# EAGLE board MSUT (EAGLE 9.6.2)
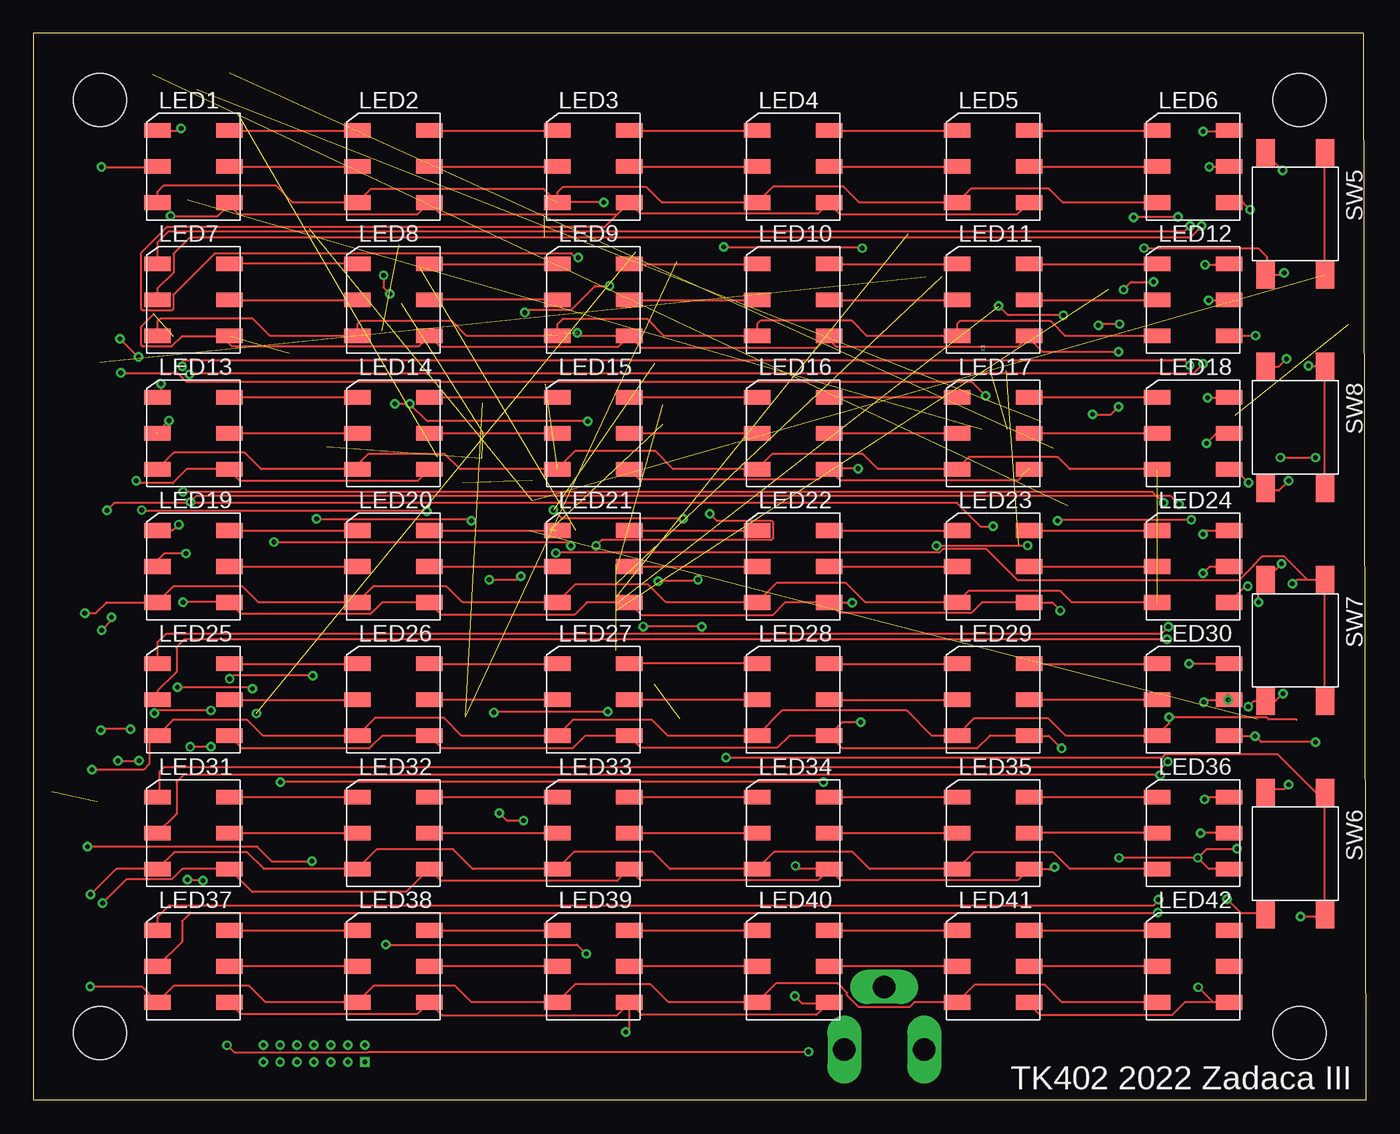
[diagram p2: board, top side]
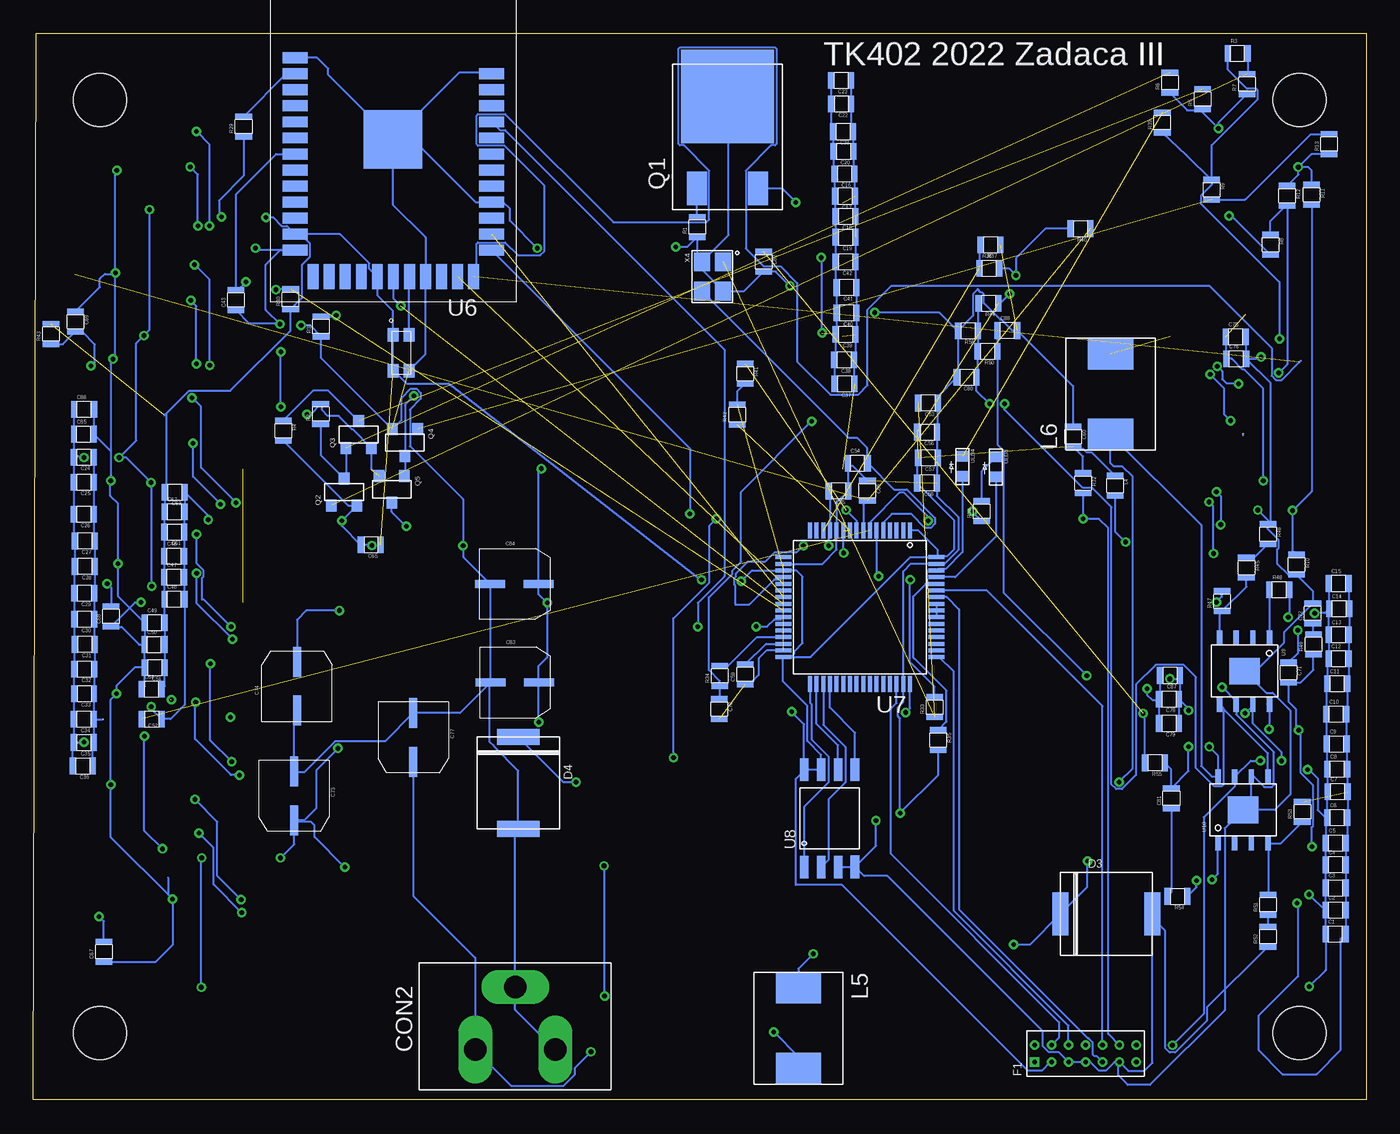
[diagram p3: board, bottom side, seen from below]

Size 100 x 80 mm. Coordinates in mm from the lower left corner, seen from the top.
Outline: 0,0 100,0 99.8,80 0,80 0,0
Copper layers (1*16): Top 0.0356mm / dielectric 1.5011mm / Bottom 0.0356mm
Design rules "oshpark-2layer-saved": minimum track width 6mil, minimum drill 13mil, track to track 4mil, track to pad 4mil, pad to pad 4mil, via to via 4mil, smd to smd 4mil, copper to edge 15mil, drill to drill 6mil, minimum pad ring 7mil, minimum via ring 7mil, stop-mask expansion 4mil, vias tented up to drill 16mil, thermal gap 10mil
Holes 4 mm at 5,5 95,5 95,75 5,75

## Footprints (pad centres in the part's own frame; a part is rotated, then mirrored left to right if it is on the bottom)
PACKAGE_0805 = smd 0.45 x 1.25: P1 0,0; P2 1.5,0
PACKAGE_EL_CAP_HXC = smd 0.6 x 2.25: P1 0,0; P2 0,-3.65
TRAY_PJ-102AH = drill 1.7 long: 1 0,-3; 2 0,3; 3 -4.7,0
D0-214AB = smd 1.2 x 3.2: ANODE 6.9,0; CATHODE 0,0
TUBE_FTSH-107-01-L-D-K = drill 0.35 square: 1 0,-0.63 | drill 0.35: 2 0,0.63; 3 1.27,-0.63; 4 1.27,0.63; 5 2.54,-0.63; 6 2.54,0.63; 7 3.81,-0.63; 8 3.81,0.63; 9 5.08,-0.63; 10 5.08,0.63; 11 6.35,-0.63; 12 6.35,0.63; 13 7.62,-0.63; 14 7.62,0.63
PACKAGE_ASPI-0630 = smd 2.35 x 3.4: PIN1 0,0; PIN2 6.05,0
TAPE&REEL_LED = smd 2 x 1.1: CI -2.7,0; CO 2.7,0; DI -2.7,2.7; DO 2.7,2.7; GND -2.7,-2.7; VDD 2.7,-2.7
TO252-3L = smd 7 x 7: DRAIN 0,0 | smd 1.5 x 2.5: GATE -2.3,-6.9; SOURCE 2.3,-6.9
SOT-23-3 = smd 0.8 x 0.9: DRAIN 0,1; GATE -0.95,-1; SOURCE 0.95,-1
FSM14JSMA = smd 1.4 x 2.1: 1 4.46,9.1; 2 4.46,0; 3 0,9.1; 4 0,0
PACKAGE_ATWINC3400-MR210XA = smd 0.813 x 1.88: BT-RXD 4.816,0; BT-TXD 6.02,0; GND@1 14.448,0; GND@2 0,0; GND@4 3.612,-14.732; GND@5 13.244,-14.732; GPIO7 2.408,-14.732; GPIO17 4.816,-14.732; GPIO18 6.02,-14.732; GPIO19 7.224,-14.732; GPIO20 8.428,-14.732; I2C-SCLM 10.836,-14.732; I2C-SCLS 2.408,0; I2C-SDAM 12.04,-14.732; I2C-SDAS 3.612,0; IRQN 9.632,-14.732; NC@1 12.04,0; NC@2 10.836,0; NC@3 9.632,0; NC@4 8.428,0; RESETN 7.224,0; SPI-CFG 13.244,0; SPI-MOSI 1.204,-14.732; SPI-SSN 0,-14.732; VDDIO 1.204,0 | smd 1.88 x 0.813: CHIP-EN -1.985,-7.367; GND@3 -1.985,-9.775; GPIO3 -1.985,-1.347; GPIO4 -1.985,-2.55; GPIO8 -1.985,-10.979; RTC-CLK -1.985,-8.572; SPI-MISO -1.985,-13.387; SPI-SCK -1.985,-12.184; UART-RXD -1.985,-4.96; UART-TXD -1.985,-3.756; VBAT -1.985,-6.163 | smd 4.4 x 4.4: GND@6 8.328,-7.318
TRAY_STM32F446RET6 = smd 1.2 x 0.3: BOOT0 -5.75,-1.75; PA3 5.75,-3.75; PA4 5.75,-2.25; PA5 5.75,-1.75; PA6 5.75,-1.25; PA7 5.75,-0.75; PA14 -5.75,3.75; PA15 -5.75,3.25; PB0 5.75,0.75; PB1 5.75,1.25; PB2 5.75,1.75; PB3 -5.75,0.75; PB4 -5.75,0.25; PB5 -5.75,-0.25; PB6 -5.75,-0.75; PB7 -5.75,-1.25; PB8 -5.75,-2.25; PB9 -5.75,-2.75; PB10 5.75,2.25; PC4 5.75,-0.25; PC5 5.75,0.25; PC10 -5.75,2.75; PC11 -5.75,2.25; PC12 -5.75,1.75; PD2 -5.75,1.25; VCAP 5.75,2.75; VDD1 5.75,-2.75; VDD2 5.75,3.75; VDD3 -5.75,-3.75; VSS1 5.75,-3.25; VSS2 5.75,3.25; VSS4 -5.75,-3.25 | smd 0.3 x 1.2: NRST -0.75,-5.75; PA0 2.75,-5.75; PA1 3.25,-5.75; PA2 3.75,-5.75; PA8 -0.25,5.75; PA9 -0.75,5.75; PA10 -1.25,5.75; PA11 -1.75,5.75; PA12 -2.25,5.75; PA13 -2.75,5.75; PB12 3.75,5.75; PB13 3.25,5.75; PB14 2.75,5.75; PB15 2.25,5.75; PC0 -0.25,-5.75; PC1 0.25,-5.75; PC2 0.75,-5.75; PC3 1.25,-5.75; PC6 1.75,5.75; PC7 1.25,5.75; PC8 0.75,5.75; PC9 0.25,5.75; PC13 -3.25,-5.75; PC14 -2.75,-5.75; PC15 -2.25,-5.75; PH0 -1.75,-5.75; PH1 -1.25,-5.75; VBAT -3.75,-5.75; VDDA 2.25,-5.75; VDDUSB -3.75,5.75; VSS3 -3.25,5.75; VSSA 1.75,-5.75
8-SOIJ = smd 1.7 x 0.65: CE 0,1.905; HOLD 7.3,0.635; MISO 0,0.635; MOSI 7.32,-1.905; SCK 7.3,-0.635; VDD 7.3,1.905; VSS 0.02,-1.905; WP 0,-0.635
8-SOIC = smd 1.1 x 0.4: BOOT 0,1.875; EN 5,-1.875; FB 0,-1.875; GND1 5,-0.625; NC1 0,0.625; NC2 0,-0.625; SW 5,1.875; VIN 5,0.625 | smd 2 x 2.3: GND2 2.5,0
TAPE&REEL_DIODE = smd 0.8 x 0.8: ANODE 1.5,0; CATHODE 0,0
PACKAGE_ASH7KW = smd 1 x 0.8: GND 2.7,0; OE 2.7,-1.2; OUT 0,0; VDD 0,-1.2
PACKAGE_FA-23816.0000MB-K0 = smd 1.4 x 1.2: 1 0,0.8; 2 2.2,0.8; 3 2.2,-0.8; 4 0,-0.8

## Placement (x,y rotation side)
C1  100nF  [PACKAGE_0805]  3.05,12.42 0 bottom
C2  100nF  [PACKAGE_0805]  3.04,14.22 0 bottom
C3  100nF  [PACKAGE_0805]  3.03,15.88 0 bottom
C4  100nF  [PACKAGE_0805]  3.03,17.61 0 bottom
C5  100nF  [PACKAGE_0805]  3.02,19.25 0 bottom
C6  100nF  [PACKAGE_0805]  2.92,21.15 0 bottom
C7  100nF  [PACKAGE_0805]  2.89,23.1 0 bottom
C8  100nF  [PACKAGE_0805]  2.91,24.8 0 bottom
C9  100nF  [PACKAGE_0805]  2.94,26.68 0 bottom
C10  100nF  [PACKAGE_0805]  2.98,28.92 0 bottom
C11  100nF  [PACKAGE_0805]  2.92,31.2 0 bottom
C12  100nF  [PACKAGE_0805]  2.82,33.08 0 bottom
C13  100nF  [PACKAGE_0805]  2.79,34.88 0 bottom
C14  100nF  [PACKAGE_0805]  2.77,36.83 0 bottom
C15  100nF  [PACKAGE_0805]  2.82,38.72 0 bottom
C16  100nF  [PACKAGE_0805]  38.41,69.44 180 bottom
C17  100nF  [PACKAGE_0805]  38.36,67.78 180 bottom
C18  100nF  [PACKAGE_0805]  38.33,66.27 180 bottom
C19  100nF  [PACKAGE_0805]  38.32,64.7 180 bottom
C20  100nF  [PACKAGE_0805]  38.48,71.14 180 bottom
C21  100nF  [PACKAGE_0805]  38.5,72.62 180 bottom
C22  100nF  [PACKAGE_0805]  38.64,74.69 180 bottom
C23  100nF  [PACKAGE_0805]  38.67,76.47 180 bottom
C24  100nF  [PACKAGE_0805]  95.48,48.2 180 bottom
C25  100nF  [PACKAGE_0805]  95.48,46.32 180 bottom
C26  100nF  [PACKAGE_0805]  95.48,43.91 180 bottom
C27  100nF  [PACKAGE_0805]  95.4,41.91 180 bottom
C28  100nF  [PACKAGE_0805]  95.39,40 180 bottom
C29  100nF  [PACKAGE_0805]  95.43,37.99 180 bottom
C30  100nF  [PACKAGE_0805]  95.42,36.03 180 bottom
C31  100nF  [PACKAGE_0805]  95.39,34.15 180 bottom
C32  100nF  [PACKAGE_0805]  95.42,32.3 180 bottom
C33  100nF  [PACKAGE_0805]  95.45,30.45 180 bottom
C34  100nF  [PACKAGE_0805]  95.48,28.53 180 bottom
C35  100nF  [PACKAGE_0805]  95.48,26.79 180 bottom
C36  100nF  [PACKAGE_0805]  95.56,25.03 180 bottom
C37  100nF  [PACKAGE_0805]  38.41,53.69 180 bottom
C38  100nF  [PACKAGE_0805]  38.43,55.49 180 bottom
C39  100nF  [PACKAGE_0805]  38.31,57.41 180 bottom
C40  100nF  [PACKAGE_0805]  38.26,59.02 180 bottom
C41  100nF  [PACKAGE_0805]  38.25,60.92 180 bottom
C42  100nF  [PACKAGE_0805]  38.32,62.84 180 bottom
C43  10nF  [PACKAGE_0805]  84.8,59.24 90 bottom
C46  100nF  [PACKAGE_0805]  90.17,40.77 0 bottom
C47  1uF  [PACKAGE_0805]  90.18,39.19 0 bottom
C48  100nF  [PACKAGE_0805]  90.16,37.54 0 bottom
C49  10uF  [PACKAGE_0805]  91.65,35.77 0 bottom
C50  100nF  [PACKAGE_0805]  91.66,34.14 0 bottom
C51  1uF  [PACKAGE_0805]  90.14,32.41 180 bottom
C52  100nF  [PACKAGE_0805]  90.38,28.55 180 bottom
C53  10pF  [PACKAGE_0805]  32.15,52.26 180 bottom
C54  10pF  [PACKAGE_0805]  38.9,47.75 0 bottom
C55  100nF  [PACKAGE_0805]  38.86,45.66 180 bottom
C56  100nF  [PACKAGE_0805]  32.19,50.08 180 bottom
C57  4.7uF  [PACKAGE_0805]  32.14,48.14 180 bottom
C58  100nF  [PACKAGE_0805]  32.21,46.26 180 bottom
C59  2.2uF  [PACKAGE_0805]  46.59,31.14 90 bottom
C60  4.7uF  [PACKAGE_0805]  22,50.5 270 bottom
C61  100nF  [PACKAGE_0805]  88.67,42.58 180 bottom
C62  100nF  [PACKAGE_0805]  90.14,44.1 0 bottom
C63  4.7uF  [PACKAGE_0805]  88.64,45.57 180 bottom
C64  100nF  [PACKAGE_0805]  91.87,30.79 0 bottom
C65  100nF  [PACKAGE_0805]  73.93,41.62 180 bottom
C66  100nF  [PACKAGE_0805]  37.42,46.44 270 bottom
C67  100nF  [PACKAGE_0805]  94.71,10.34 90 bottom
C68  100nF  [PACKAGE_0805]  94.17,35.5 90 bottom
C69  100nF  [PACKAGE_0805]  96.85,59.11 270 bottom
C70  100nF  [PACKAGE_0805]  48.53,30.07 270 bottom
C71  10nF  [PACKAGE_0805]  5.83,32.78 270 bottom
C72  dnp  [PACKAGE_0805]  4.01,35.73 90 bottom
C73  HHXC250ARA470MF61G  [PACKAGE_EL_CAP_HXC]  80.44,20.96 180 bottom
C74  HHXC250ARA470MF61G  [PACKAGE_EL_CAP_HXC]  80.22,32.84 0 bottom
C75  4.7uF  [PACKAGE_0805]  10.54,57.23 0 bottom
C76  100nF  [PACKAGE_0805]  10.49,55.58 0 bottom
C77  HHXB350ARA470MF61G  [PACKAGE_EL_CAP_HXC]  71.49,25.35 180 bottom
C78  100nF  [PACKAGE_0805]  14.06,30.05 180 bottom
C79  4.7uF  [PACKAGE_0805]  14.07,28.22 180 bottom
C80  100nF  [PACKAGE_0805]  29.23,54.18 180 bottom
C81  10nF  [PACKAGE_0805]  14.62,21.86 90 bottom
C82  dnp  [PACKAGE_0805]  45.21,63.62 270 bottom
C83  HHXC250ARA470MF61G  [PACKAGE_EL_CAP_HXC]  62.05,31.3 270 bottom
C84  HHXC250ARA470MF61G  [PACKAGE_EL_CAP_HXC]  62.08,38.7 270 bottom
C85  4.7uF  [PACKAGE_0805]  96.95,49.93 0 bottom
C86  100nF  [PACKAGE_0805]  96.94,51.78 0 bottom
C87  100nF  [PACKAGE_0805]  13.99,31.82 180 bottom
C88  4.7uF  [PACKAGE_0805]  27.66,57.7 0 bottom
CON2  PJ-102AH  [TRAY_PJ-102AH]  63.84,3.74 270 bottom
D3  SK54  [D0-214AB]  22.94,13.93 0 bottom
D4  SK54  [D0-214AB]  63.62,27.19 270 bottom
F1  FTSH-107-01-L-D-K  [TUBE_FTSH-107-01-L-D-K]  24.87,3.45 0 bottom
L4  742792651  [PACKAGE_0805]  18.85,46.82 270 bottom
L5  ASPI-0630LR-100M-T15  [PACKAGE_ASPI-0630]  42.6,8.38 270 bottom
L6  ASPI-0630LR-100M-T15  [PACKAGE_ASPI-0630]  19.18,49.91 90 bottom
LED1  RGB_LED  [TAPE&REEL_LED]  12,70 0 top
LED2  RGB_LED  [TAPE&REEL_LED]  27,70 0 top
LED3  RGB_LED  [TAPE&REEL_LED]  42,70 0 top
LED4  RGB_LED  [TAPE&REEL_LED]  57,70 0 top
LED5  RGB_LED  [TAPE&REEL_LED]  72,70 0 top
LED6  RGB_LED  [TAPE&REEL_LED]  87,70 0 top
LED7  RGB_LED  [TAPE&REEL_LED]  12,60 0 top
LED8  RGB_LED  [TAPE&REEL_LED]  27,60 0 top
LED9  RGB_LED  [TAPE&REEL_LED]  42,60 0 top
LED10  RGB_LED  [TAPE&REEL_LED]  57,60 0 top
LED11  RGB_LED  [TAPE&REEL_LED]  72,60 0 top
LED12  RGB_LED  [TAPE&REEL_LED]  87,60 0 top
LED13  RGB_LED  [TAPE&REEL_LED]  12,50 0 top
LED14  RGB_LED  [TAPE&REEL_LED]  27,50 0 top
LED15  RGB_LED  [TAPE&REEL_LED]  42,50 0 top
LED16  RGB_LED  [TAPE&REEL_LED]  57,50 0 top
LED17  RGB_LED  [TAPE&REEL_LED]  72,50 0 top
LED18  RGB_LED  [TAPE&REEL_LED]  87,50 0 top
LED19  RGB_LED  [TAPE&REEL_LED]  12,40 0 top
LED20  RGB_LED  [TAPE&REEL_LED]  27,40 0 top
LED21  RGB_LED  [TAPE&REEL_LED]  42,40 0 top
LED22  RGB_LED  [TAPE&REEL_LED]  57,40 0 top
LED23  RGB_LED  [TAPE&REEL_LED]  72,40 0 top
LED24  RGB_LED  [TAPE&REEL_LED]  87,40 0 top
LED25  RGB_LED  [TAPE&REEL_LED]  12,30 0 top
LED26  RGB_LED  [TAPE&REEL_LED]  27,30 0 top
LED27  RGB_LED  [TAPE&REEL_LED]  42,30 0 top
LED28  RGB_LED  [TAPE&REEL_LED]  57,30 0 top
LED29  RGB_LED  [TAPE&REEL_LED]  72,30 0 top
LED30  RGB_LED  [TAPE&REEL_LED]  87,30 0 top
LED31  RGB_LED  [TAPE&REEL_LED]  12,20 0 top
LED32  RGB_LED  [TAPE&REEL_LED]  27,20 0 top
LED33  RGB_LED  [TAPE&REEL_LED]  42,20 0 top
LED34  RGB_LED  [TAPE&REEL_LED]  57,20 0 top
LED35  RGB_LED  [TAPE&REEL_LED]  72,20 0 top
LED36  RGB_LED  [TAPE&REEL_LED]  87,20 0 top
LED37  RGB_LED  [TAPE&REEL_LED]  12,10 0 top
LED38  RGB_LED  [TAPE&REEL_LED]  27,10 0 top
LED39  RGB_LED  [TAPE&REEL_LED]  42,10 0 top
LED40  RGB_LED  [TAPE&REEL_LED]  57,10 0 top
LED41  RGB_LED  [TAPE&REEL_LED]  72,10 0 top
LED42  RGB_LED  [TAPE&REEL_LED]  87,10 0 top
Q1  MOSFET_DMN6068LK3-13  [TO252-3L]  47.92,75.27 0 bottom
Q2  NCHANNEL_MOSFET  [SOT-23-3]  76.68,45.58 0 bottom
Q3  PCHANNEL_MOSFET  [SOT-23-3]  75.59,49.9 0 bottom
Q4  NCHANNEL_MOSFET  [SOT-23-3]  72.12,49.3 180 bottom
Q5  PCHANNEL_MOSFET  [SOT-23-3]  73.11,45.78 180 bottom
R1  56k  [PACKAGE_0805]  50.2,64.72 90 bottom
R2  dnp  [PACKAGE_0805]  78.44,50.67 90 bottom
R3  dnp  [PACKAGE_0805]  10.4,78.5 0 bottom
R4  dnp  [PACKAGE_0805]  81.25,50.95 270 bottom
R5  dnp  [PACKAGE_0805]  12.27,74.3 90 bottom
R6  dnp  [PACKAGE_0805]  14.73,75.54 90 bottom
R7  0  [PACKAGE_0805]  8.95,75.43 90 bottom
R8  dnp  [PACKAGE_0805]  7.18,64.9 270 bottom
R9  dnp  [PACKAGE_0805]  11.59,69.03 270 bottom
R10  dnp  [PACKAGE_0805]  5.23,40.88 270 bottom
R11  dnp  [PACKAGE_0805]  4.09,68.63 270 bottom
R12  dnp  [PACKAGE_0805]  5.93,68.57 270 bottom
R13  0  [PACKAGE_0805]  2.78,70.93 90 bottom
R29  10k  [PACKAGE_0805]  84.22,72.26 90 bottom
R30  100k  [PACKAGE_0805]  80.7,59.29 90 bottom
R31  100k  [PACKAGE_0805]  78.41,57.26 90 bottom
R32  33k  [PACKAGE_0805]  21.25,46.99 270 bottom
R33  0  [PACKAGE_0805]  32.38,28.69 90 bottom
R34  0  [PACKAGE_0805]  48.51,31.02 90 bottom
R35  10k  [PACKAGE_0805]  32.11,27.74 270 bottom
R36  10k  [PACKAGE_0805]  29.03,62.37 0 bottom
R37  NCU18XH103F60RB  [PACKAGE_0805]  27.45,64.13 180 bottom
R38  470  [PACKAGE_0805]  28.85,43.39 90 bottom
R39  680  [PACKAGE_0805]  15.3,72.55 90 bottom
R40  56k  [PACKAGE_0805]  20.71,65.34 180 bottom
R41  56k  [PACKAGE_0805]  46.6,55.22 270 bottom
R42  56k  [PACKAGE_0805]  47.19,50.63 90 bottom
R43  56k  [PACKAGE_0805]  98.68,56.67 90 bottom
R44  56k  [PACKAGE_0805]  27.6,59.75 180 bottom
R45  2.2k  [PACKAGE_0805]  8.99,40.66 270 bottom
R46  1k  [PACKAGE_0805]  7.37,43.19 270 bottom
R47  10k  [PACKAGE_0805]  10.82,36.64 90 bottom
R48  0  [PACKAGE_0805]  7.27,38.26 0 bottom
R49  dnp  [PACKAGE_0805]  3.96,33.39 90 bottom
R50  82k  [PACKAGE_0805]  27.66,56.14 180 bottom
R51  5.6k  [PACKAGE_0805]  7.37,13.85 90 bottom
R52  220  [PACKAGE_0805]  7.38,11.46 90 bottom
R53  10k  [PACKAGE_0805]  4.79,20.83 90 bottom
R54  0  [PACKAGE_0805]  13.41,15.24 180 bottom
R55  dnp  [PACKAGE_0805]  15.1,25.26 180 bottom
R56  33k  [PACKAGE_0805]  29.15,57.67 180 bottom
SW5  FSM14JSMA  [FSM14JSMA]  96.9,71 180 top
SW6  FSM14JSMA  [FSM14JSMA]  96.9,23 180 top
SW7  FSM14JSMA  [FSM14JSMA]  96.9,39 180 top
SW8  FSM14JSMA  [FSM14JSMA]  96.9,55 180 top
U6  NETWORK_CONTROLLER  [PACKAGE_ATWINC3400-MR210XA]  80.35,63.72 90 bottom
U7  STM32F446RET6  [TRAY_STM32F446RET6]  37.98,36.95 180 bottom
U8  SST26VF032B-104I/SM  [8-SOIJ]  40.26,17.44 90 bottom
U9  RT8289GSP  [8-SOIC]  9.13,34.65 270 bottom
U10  RT8289GSP  [8-SOIC]  9.24,19.23 90 bottom
ULD3  L196L-QYC-TR  [TAPE&REEL_DIODE]  27.78,48.22 270 bottom
ULD4  L196L-OYC-TR  [TAPE&REEL_DIODE]  30.29,48.26 270 bottom
X3  ASH7KW-32.768KHZ-L-T  [PACKAGE_ASH7KW]  71.81,57.38 270 bottom
X4  FA-238  [PACKAGE_FA-23816.0000MB-K0]  49.05,62.86 270 bottom

## Tracks (layer width: path | path; a pad name or v marks a point on that pad's centre or on a via)
3V3  (via drill 0.35)  (6 unrouted)
  Top 0.152: v43.11,29.1 34.6,29.1 v34.54,29.04 | v49.87,39 49.79,38.92 46.93,38.92 v46.89,38.88 | v85.88,66.22 82.58,66.22 v82.55,66.19 | v26.28,61.85 26.28,60.93 v26.75,60.46
  Bottom 0.152: U7.VBAT 33.61,42.7 32.18,41.27 32.18,40.75 | 42.12,24.74 U8.HOLD 40.9,25.86 41.92,26.89 41.92,29.53 43.77,31.38 43.77,33.2 U7.VDD2 | 42.12,24.74 U8.VDD 42.16,28.15 v43.11,29.1 | v34.54,29.04 34.23,29.35 U7.VDDUSB | F1.3 23.69,2.82 24.35,2.16 25.39,2.16 39.32,16.09 42.8,16.09 42.8,24.06 42.12,24.74 | 32.18,40.75 U7.VDD3 34.19,40.7 41.69,33.2 U7.VDD2 | U7.VDD2 43.16,33.2 42.9,33.45 42.9,33.63 42.28,34.25 42.28,39.23 42.75,39.7 U7.VDD1 46.07,39.7 v46.89,38.88 | 79.83,64.92 76.98,64.92 74.81,62.75 74.81,62.35 U6.VBAT 74.19,60.34 73.01,59.16 X3.VDD X3.OE 72.96,54.68 72,53.72 68.82,53.72 49.95,39.03 49.9,39.03 v49.87,39 | 79.83,64.92 U6.VDDIO 80.97,65.54 81.36,65.54 82.01,66.19 v82.55,66.19 | 32.18,40.75 31.45,40.75 30.91,41.28 30.91,43.46 C58.P2 33.71,48.07 C57.P2 | 90.17,51.34 90.03,51.48 | 90.03,51.48 88.32,53.19 85.22,53.19 80.7,57.71 R30.P1 79.83,60.16 79.83,62.64 79.23,63.24 79.23,64.2 79.83,64.8 79.83,64.92 | R29.P1 84.22,69.31 86.07,67.46 86.07,66.41 v85.88,66.22 | R32.P1 21.25,48.25 21.82,48.83 | 21.82,48.83 C60.P2 | C64.P2 90.14,31.02 C51.P1 90.16,32.43 C50.P2 C49.P2 C48.P1 90.16,39.17 C47.P1 C46.P1 C61.P2 90.17,44.07 C62.P1 C63.P2 90.03,45.69 90.03,51.48 | L4.P1 20.59,48.56 20.95,48.56 21.22,48.83 21.82,48.83 | R36.P2 26.8,62.37 v26.28,61.85 26.28,63.14 24.08,65.34 R40.P2 | v26.75,60.46 27.46,59.75 R44.P1 | R41.P2 47.19,53.13 R42.P2
5V  (via drill 0.35)  (5 unrouted)
  Top 0.152: LED41.VDD 74.7,7.19 75.56,6.33 85.42,6.33 86.39,7.3 LED42.VDD 88.52,7.3 v87.4,8.42 | 89.09,17.3 LED36.VDD | LED40.VDD 59.63,7.23 | 59.63,7.23 58.75,6.35 45.65,6.35 44.74,7.26 | 44.74,7.26 LED39.VDD 44.7,5.32 v44.45,5.07 | LED37.VDD 15.6,6.4 28.8,6.4 LED38.VDD 30.67,6.33 43.81,6.33 44.74,7.26 | LED34.VDD 58.85,16.45 45.55,16.45 LED33.VDD 43.8,16.4 30.6,16.4 LED32.VDD 27.97,15.57 16.43,15.57 LED31.VDD 11.17,17.3 10.39,16.52 6.98,16.52 v5.2,14.74 | LED34.VDD 60.55,16.45 73.85,16.45 LED35.VDD 76.15,17.3 76.19,17.26 76.46,17.26 v76.63,17.43 | LED36.VDD 88.2,17.3 v87.37,18.13 | LED25.VDD 15.67,26.33 25.2,26.33 25.39,26.52 26.17,27.3 LED26.VDD 30.67,26.33 40.44,26.33 41.41,27.3 LED27.VDD 45.61,26.39 55.81,26.39 56.72,27.3 LED28.VDD | LED28.VDD 59.75,27.3 60.72,26.33 70.79,26.33 71.76,27.3 LED29.VDD 76.19,27.3 v77.14,26.35 | 89.96,17.3 LED36.VDD | LED22.VDD 56.41,37.3 55.44,36.33 45.67,36.33 LED21.VDD 41.53,37.3 40.6,36.37 30.63,36.37 LED20.VDD 26.17,37.3 25.39,36.52 25.38,36.52 25.28,36.42 15.58,36.42 LED19.VDD 14.68,37.32 v11.24,37.32 | LED22.VDD 60.48,36.52 70.39,36.52 71.17,37.3 LED23.VDD 76.44,37.3 v77.05,36.69 | LED22.VDD 61.43,37.3 v61.45,37.28 | 89.74,37.26 LED24.VDD 90.91,38.51 v91.12,38.51 | LED14.VDD 28.82,46.42 15.51,46.42 14.7,47.23 LED13.VDD 11.51,47.3 10.46,46.25 7.9,46.25 v7.72,46.43 | LED15.VDD 45.49,46.51 58.91,46.51 LED16.VDD 59.83,47.17 | LED17.VDD 73.86,46.46 60.54,46.46 59.83,47.17 | LED18.VDD 89.88,47.12 90.34,47.12 v91.17,46.29 | LED9.VDD 43.86,56.46 30.54,56.46 LED8.VDD 28.9,56.5 14.92,56.5 14.7,56.72 LED7.VDD 11.17,57.3 10.39,56.52 8.21,56.52 8.07,56.66 8.07,57.95 9.04,58.91
  Top 0.152: LED9.VDD 45.63,56.37 58.77,56.37 LED10.VDD 59.7,57.03 60.27,56.46 73.86,56.46 74.62,57.22 | LED11.VDD 74.62,57.22 | 89.75,57.26 LED12.VDD 91.69,57.3 v91.71,57.32 | 14.7,67.17 15.46,66.41 28.81,66.41 LED2.VDD 30.59,66.41 43.81,66.41 LED3.VDD | 14.7,67.17 LED1.VDD | LED3.VDD 45.54,66.46 58.86,66.46 LED4.VDD 59.7,67.25 60.54,66.41 73.81,66.41 LED5.VDD | LED28.VDD 60.72,28.32 v62.08,28.32 | LED3.VDD 42.85,65.45 10.02,65.45 8.07,63.5 8.07,59.35 8.21,59.22 10.39,59.22 10.53,59.35 10.53,60.4 13.61,63.48 40.4,63.48 40.7,63.17 v40.89,63.17 | LED30.VDD 91.64,27.3 v91.67,27.27 92.12,26.82 v96.19,26.82 | LED34.VDD 59.6,17.4 | LED34.VDD 57.41,17.3 v57.18,17.53 | v57.14,7.76 57.67,7.23 59.63,7.23 | v87.37,18.13 v81.45,18.13 | v87.37,18.13 88.05,18.81 v90.31,18.81 | v93.56,48.17 v96.2,48.17 | LED6.VDD 90.76,67.3 v91.29,66.77 | v61.89,47.34 59.99,47.34 59.83,47.17 | LED9.VDD 44.53,57.47 | LED9.VDD 41.04,57.3 v40.82,57.52 | v79.47,51.41 80.86,51.41 v81.43,51.98 | v81.43,56.09 75.75,56.09 74.62,57.22 | v10.3,66.3 13.83,66.3 14.7,67.17
  Bottom 0.152: v81.45,18.13 80.42,19.16 80.42,20.85 | 80.42,20.85 80.42,20.94 C73.P1 79.68,20.96 78.78,21.86 78.78,24.71 v77.14,26.35 | v76.63,17.43 78.9,19.7 78.9,20.58 79.17,20.85 80.42,20.85 | 62.08,31.33 62.13,31.38 62.13,32.48 61.45,33.16 v61.45,37.28 62.08,37.91 C84.P1 62.08,47.15 v61.89,47.34 | 62.08,31.33 C83.P1 | v77.05,36.69 79.53,36.69 80.22,36 C74.P1 | v62.08,28.32 62.08,31.33 | v44.45,5.07 42.6,3.22 L5.PIN2 | C15.P2 1.32,36.88 C14.P2 1.27,34.9 C13.P2 1.32,34.85 C12.P2 1.32,31.3 C11.P2 1.42,28.98 C10.P2 1.48,26.72 C9.P2 1.44,24.83 C8.P2 1.41,23.12 C7.P2 1.39,21.18 C6.P2 1.42,19.35 C5.P2 C4.P2 C3.P2 C2.P2 C1.P2 1.91,12.06 1.91,3.72 3.72,1.91 6.28,1.91 8.09,3.72 8.09,6.28 5.13,9.24 5.13,14.67 v5.2,14.74 | C36.P2 97.06,26.71 C35.P2 | C35.P2 C34.P2 96.95,28.56 C33.P2 96.92,30.48 C32.P2 96.92,34.12 C31.P2 96.92,34.18 C30.P2 C29.P2 96.93,39.96 C28.P2 C27.P2 96.98,41.99 C26.P2 C25.P2 C24.P2 96.95,48.23 | v57.18,17.53 57.18,7.8 v57.14,7.76 | C37.P2 39.91,55.47 C38.P2 39.81,55.61 C39.P2 | C39.P2 39.76,57.46 C40.P2 C41.P2 39.82,60.99 C42.P2 C19.P2 C18.P2 39.83,67.75 C17.P2 39.86,69.39 C16.P2 39.98,69.51 C20.P2 40,71.16 C21.P2 40.14,72.76 C22.P2 40.17,74.72 C23.P2 | 96.95,48.23 C85.P1 C86.P1 | C35.P2 96.22,26.79 v96.19,26.82 | C75.P1 10.54,55.63 C76.P1 10.09,55.58 9.29,54.78 9.15,54.78 7.72,53.35 v7.72,46.43 | v87.4,8.42 87.4,18.1 v87.37,18.13 | v90.31,18.81 91.67,20.17 v91.67,27.27 | v91.12,38.51 91.12,46.24 v91.17,46.29 93.05,48.17 v93.56,48.17 92.28,49.45 92.28,56.75 v91.71,57.32 91.29,57.74 v91.29,66.77 | v96.2,48.17 96.26,48.23 96.95,48.23 | Q5.SOURCE 74.64,47.36 Q3.SOURCE 76.01,50.27 76.06,50.27 77.09,51.3 77.91,51.3 78.33,51.72 78.33,52.17
  Bottom 0.152: v11.24,37.32 10.82,37.74 R47.P2 | 39.87,57.47 C39.P2 | v40.82,57.52 40.82,63.11 v40.89,63.17 | v79.47,51.41 79.2,51.41 R2.P2 78.33,52.17 | v81.43,51.98 v81.43,56.09 | 78.33,52.17 77.96,52.17 | R8.P2 10.08,66.3 v10.3,66.3
12V  (via drill 0.35)
  Top 0.152: v6.34,25.41 v7.95,25.41 v7.94,25.42 | v58.16,3.58 25.12,3.58 25.09,3.55 15.06,3.55 v14.54,4.07 | v13.31,29.19 9.29,29.19 v9.09,29 | v20.96,31.81 14.98,31.81 v14.73,31.56
  Bottom 0.152: C77.P1 71.49,15.3 66.84,10.65 CON2.1 64.11,1.01 60.24,1.01 59.39,1.86 59.39,2.35 v58.16,3.58 | v7.94,25.42 8.68,25.42 U10.VIN 9.87,23.51 12.19,21.18 12.19,6.42 v14.54,4.07 | v6.34,25.41 6.34,26.04 8.51,28.2 8.51,29.55 | 8.51,29.55 U9.VIN | C79.P1 C78.P1 | C78.P1 13.31,29.3 v13.31,29.19 | v9.09,29 9.06,29 8.51,29.55 | C87.P1 13.99,31.67 | 13.99,31.67 13.99,30.12 C78.P1 | v20.96,31.81 27.2,38.05 27.2,48.69 27.66,49.15 R50.P1 C88.P1 | v14.73,31.56 14.1,31.56 13.99,31.67
BTN0  (2 unrouted)
  Top 0.152: SW5.3 SW5.4
  Bottom 0.152: C66.P2 37.73,44.63 U7.PC0
BTN1  (via drill 0.35)  (1 unrouted)
  Top 0.152: v95.07,13.73 96.73,13.73 SW6.3 SW6.4 96.25,23 93.36,25.89 84.9,25.89 84.66,25.65 v51.97,25.65 | v39.02,44.23 39.67,43.58 v48.75,43.58
  Bottom 0.152: C67.P2 94.71,13.37 v95.07,13.73 | v48.75,43.58 49.28,43.05 49.28,38.79 51.97,36.1 v51.97,25.65 | v39.02,44.23 38.23,43.44 U7.PC1
BTN2  (via drill 0.35)  (2 unrouted)
  Top 0.152: SW7.3 SW7.4 | SW7.4 94.76,39 v94.46,38.7 | SW7.4 95.6,39 93.86,40.74 92.18,40.74 91.56,40.12 91.56,40.06 90.45,38.95 73.85,38.95 71.49,41.31 68.26,41.31 67.98,41.03 39.23,41.03 v39.21,41
  Bottom 0.152: v94.46,38.7 94.17,38.41 C68.P2 | v39.21,41 39.21,42.68 U7.PC3
BTN3  (via drill 0.35)
  Top 0.152: SW8.3 SW8.4 95.72,55 v95.67,55.05
  Bottom 0.152: v95.67,55.05 95.39,55.33 95.39,56.66 96.34,57.61 C69.P2 97.79,56.67 R43.P1
CHG-EN  (via drill 0.35)
  Top 0.152: v27.13,52.21 28.23,52.21 v28.25,52.19 29.55,50.89 v41.61,50.89
  Bottom 0.152: U10.EN 7.37,25.98 11.01,29.62 U9.EN 10.74,29.38 10.74,23.61 10.84,23.5 11.39,23.5 12.76,24.88 12.76,31.7 13.69,32.62 15.79,32.62 17.27,31.14 17.27,24.34 18.32,23.29 18.76,23.29 19.11,23.64 19.11,44.45 20.55,45.89 21.25,45.89 27.13,51.77 v27.13,52.21 | v28.25,52.19 29.23,53.17 C80.P1 29.16,54.25 R50.P2 R56.P1 29.15,59.7 R44.P2 | C70.P1 48.53,31 R34.P1 48.51,31.42 49.31,32.22 49.31,37.68 47.56,39.43 47.56,39.68 46.9,40.34 46.9,45.6 v41.61,50.89
CI1  (via drill 0.35)
  Top 0.152: v5.1,69.96 9.26,69.96 LED1.CI
  Bottom 0.152: R11.P1 4.09,69.7 4.35,69.96 5.08,69.96 | 5.08,69.96 v5.09,69.96 | v5.09,69.96 v5.1,69.96 | R12.P1 5.09,69.41 v5.09,69.96 | R13.P1 4.11,70.93 5.08,69.96
CO1
  Top 0.152: LED7.CO LED8.CI
CO2
  Top 0.152: LED14.CO LED15.CI
CO3
  Top 0.152: LED21.CO LED22.CI
CO4
  Top 0.152: LED28.CO LED29.CI
CO5
  Top 0.152: LED36.CI LED35.CO
DI1  (via drill 0.35)
  Top 0.152: LED1.DI 10.92,72.7 v11.09,72.87
  Bottom 0.152: 12.27,74.23 12.27,74.05 v11.09,72.87 11.09,73.29 R7.P1 | 12.27,74.23 R5.P1 | R6.P1 13.42,74.23 12.27,74.23
DO1
  Top 0.152: LED7.DO 14.72,62.72 24.28,62.72 LED8.DI
DO2
  Top 0.152: LED14.DO LED15.DI
DO3
  Top 0.152: LED21.DO LED22.DI
DO4
  Top 0.152: LED28.DO LED29.DI
DO5
  Top 0.152: LED35.DO LED36.DI
F446-DRX
  Bottom 0.152: U7.PB7 32.13,38.2 31.66,38.2 28.47,38.2 19.79,29.52 F1.10
F446-DTX
  Bottom 0.152: F1.9 20.24,3.27 20.42,3.27 20.53,3.38 20.53,4.3 20.84,4.61 20.88,4.61 30.55,14.28 30.55,36.78 31.47,37.7 U7.PB6
F446-NRST  (via drill 0.35)  (1 unrouted)
  Top 0.152: v21.25,43.57 32.73,43.57 v32.87,43.43
  Bottom 0.152: F1.12 19.36,4.92 19.36,42.89 20.04,43.57 v21.25,43.57 R32.P2 | v32.87,43.43 32.87,43.73 34.67,45.53 35,45.53 37.23,43.3 U7.NRST
F446-SWDCLK
  Bottom 0.152: F1.6 22.33,5.55 30.95,14.17 30.95,32.11 32.04,33.2 U7.PA14
F446-SWDIO
  Bottom 0.152: U7.PA13 35.23,29.75 35.65,29.33 35.65,18.42 23.04,5.81 23.04,4.64 F1.4
FLASH-CS
  Bottom 0.152: U7.PB12 41.73,29.77 41.62,29.66 41.62,27.02 40.34,25.74 40.34,23.8 42.16,21.97 U8.CE
FLASH-MISO
  Bottom 0.152: U7.PB14 40.73,28.11 39.07,26.45 39.07,23.8 40.34,22.52 40.34,17.99 U8.MISO
FLASH-MOSI
  Bottom 0.152: U8.MOSI 38.35,27.52 40.24,29.41 U7.PB15
FLASH-SCK
  Bottom 0.152: U8.SCK 39.62,26.57 41.23,28.18 U7.PB13
GND  (via drill 0.35)  (5 unrouted)
  Top 0.152: v36.78,20.92 35.54,20.92 v34.97,21.49 | SW8.1 92.44,45.69 93.46,45.69 v94.19,46.42 | SW7.1 | SW6.1 92.44,14.01 90.6,14.01 v89.56,15.05 | v93.76,30.46 93.19,29.89 SW7.1 | SW5.1 92.54,61.9 | 92.54,61.9 93.72,61.9 v93.85,62.03 | v93.74,69.7 SW5.2 | SW8.2 93.46,55 v94.02,55.56 | v93.64,40.21 v93.64,40.2 SW7.2 91.92,38.48 v91.92,37.31 | SW6.2 92.73,23.29 93.85,23.29 v94.19,23.63 | v10.81,30.94 16.33,30.94 v16.44,30.83 | v91.15,29.48 91.56,29.89 SW7.1 | v51.81,63.97 62.1,63.97 v62.19,63.88 | v86.88,43.5 76.91,43.5 v76.84,43.43 | v67.76,41.56 v74.6,41.56 v74.61,41.57 | v36.88,59.05 37.1,59.27 40.37,59.27 42.14,61.04 v43.23,61.04 | v29.53,44.14 8.22,44.14 v8.13,44.23 | v6.51,57.07 v7.87,55.71 v7.88,55.71 | v81.49,58.18 79.99,58.18 v79.91,58.1 | v83.33,63.88 91.89,63.88 92.54,63.23 92.54,61.9
  Bottom 0.152: 65.73,31.33 C84.P2 67.71,40.68 67.71,41.56 v67.76,41.56 67.76,45.04 71.75,49.03 71.75,51.76 70.93,52.58 70.93,53.02 71.24,53.33 71.68,53.33 72.37,52.64 72.37,51 Q4.SOURCE 78.41,55.64 R31.P1 79.25,58.1 v79.91,58.1 | 65.73,31.33 C83.P2 68,29 C77.P2 73.61,26.88 77.36,26.88 79.69,24.55 80.5,24.55 | Q1.DRAIN 47.84,75.27 | 47.84,75.27 47,75.27 | 18.61,2.82 F1.11 17.85,2.15 16.64,2.15 16.04,2.75 16.04,13.63 | 18.61,2.82 18.86,2.82 19.52,2.16 20.06,2.16 20.72,2.82 F1.7 F1.5 23.06,3.55 23.82,3.55 24.25,3.98 24.25,5.11 | 16.04,13.63 D3.ANODE | 24.25,5.1 24.25,5.11 | 24.25,5.11 35.93,16.78 37.67,16.78 U8.VSS | U8.WP 38.38,17.44 U8.VSS | U8.VSS 36.78,19.04 v36.78,20.92 | U7.VSS3 34.73,29.82 35.15,29.4 35.15,28.79 34.97,28.61 v34.97,21.49 32.11,24.35 R35.P2 | 34.7,31.23 U7.VSS3 | U7.VSS3 34.73,39.62 34.14,40.21 U7.VSS4 31.64,40.2 30.6,41.24 30.6,43.69 32.21,45.3 C58.P1 32.21,48.07 32.19,48.09 | CON2.2 63.84,6.74 CON2.3 63.84,20.07 D4.ANODE 63.62,24.67 65.45,26.5 65.45,26.52 65.78,26.85 65.78,31.28 65.73,31.33 | U10.GND2 8.62,22.36 U10.GND1 8.44,24.23 7.66,23.45 7.07,23.45 6.93,23.59 6.93,26.07 9.76,28.89 U9.GND1 9.76,29.89 v10.81,30.94 | U10.GND2 10.61,20.36 10.61,6.71 16.23,1.09 17.89,1.09 18.61,1.81 18.61,2.82 | C74.P2 80.44,28.97 C73.P2 80.5,24.55 | 80.5,24.55 80.6,24.45 | 89.89,16.65 89.89,15.38 v89.56,15.05 | U9.GND2 9.06,32.09 | 9.06,32.09 7.49,30.51 7.02,30.51 5.69,29.18 5.69,22.88 6.84,21.73 U10.GND2 | X3.GND 70.58,55.92 U6.GND@3 70.58,64.69 73.03,67.15 U6.GND@6 | C50.P1 C49.P1 93.64,37.76 v93.64,40.21 93.64,44.71 94.22,45.29 94.22,46.39 v94.19,46.42 94.19,48.67
  Bottom 0.152: C51.P2 91.64,34.12 C50.P1 | C51.P2 92.41,32.41 93.76,31.06 v93.76,30.46 94.19,30.03 v94.19,23.63 94.19,19.68 v89.56,15.05 | U7.VSS2 44.99,33.7 45.59,33.1 45.59,31.85 46.3,31.14 C59.P1 | U7.VSS1 40.79,40.2 39.73,41.26 U7.VSSA 39.73,44.79 C55.P1 38.9,45.7 38.9,47.52 | 32.19,48.09 C56.P1 32.15,50.12 C53.P1 32.15,52.76 C80.P2 30.65,54.26 R56.P2 | C57.P1 32.19,48.09 | C54.P1 38.9,47.52 | X4.4 49.85,62.26 X4.2 46.67,60.66 C82.P2 44.31,62.12 v43.23,61.04 | X4.4 47.84,64.87 47.84,75.27 | 94.19,48.67 C85.P2 C86.P2 | v93.74,69.7 93.85,69.59 v93.85,62.03 93.85,61.95 | 93.85,61.95 93.85,55.73 v94.02,55.56 94.19,55.39 94.19,48.67 | C75.P2 9.04,55.63 C76.P2 | 15.56,29.97 C78.P2 15.49,30.12 C87.P2 | 15.56,29.97 C79.P2 | 9.06,32.09 8.37,32.09 6.18,34.27 6.18,35.06 C72.P2 4.01,38.16 R10.P2 5.85,39.38 6.66,40.19 6.66,41.3 6.57,41.39 6.57,41.99 7.37,42.79 R46.P1 | C66.P1 38.5,47.52 38.9,47.52 | R52.P1 11.94,6.9 11.94,5.92 14.32,3.54 14.76,3.54 15.07,3.85 15.07,12.66 16.04,13.63 | v16.44,30.83 16.44,30.37 16.04,29.97 15.56,29.97 | v91.15,29.48 91.15,29.32 C52.P1 89.7,28.55 89.02,29.23 89.04,29.23 88.66,29.61 C48.P2 88.68,37.56 C47.P2 C46.P2 88.69,40.79 88.69,42.56 C61.P1 88.67,44.07 C62.P2 C63.P1 86.88,43.81 v86.88,43.5 | X4.4 50.2,63.21 R1.P1 50.95,63.97 v51.81,63.97 | v62.19,63.88 64.25,65.94 64.25,66.83 64.75,67.33 U6.GND@4 66.83,67.33 71.55,72.05 U6.GND@6 | C69.P1 95.01,60.95 95.01,61.58 94.64,61.95 93.85,61.95 | C64.P1 91.64,31.02 C51.P2 | C50.P1 92.06,34.14 93.38,35.46 94.13,35.46 C68.P1 92.36,37.31 v91.92,37.31 | v74.61,41.57 74.66,41.62 C65.P2 76.84,43.03 v76.84,43.43 75.73,44.54 Q2.SOURCE 76.38,44.58 R4.P2
  Bottom 0.152: C67.P1 90.81,10.34 89.51,11.64 89.51,15 v89.56,15.05 | U6.GND@6 68.01,77.07 65.72,77.07 U6.GND@5 | U6.GND@6 77.87,76.89 77.87,77.35 78.69,78.17 U6.GND@1 | C76.P2 7.19,53.78 7.19,43.37 R46.P1 | C60.P1 22,53.54 C88.P2 26.56,57.7 27.36,58.5 27.45,58.5 28.7,59.75 28.7,60.45 28.8,60.55 28.89,60.55 29.14,60.81 29.5,60.45 29.5,58.82 R56.P2 | R56.P2 32.03,59.05 v36.88,59.05 | R38.P1 29.53,44.07 v29.53,44.14 | v8.13,44.23 7.37,43.47 R46.P1 | R3.P1 10.4,77.28 8.95,75.83 8.25,75.83 8.15,75.73 8.15,75.06 11.59,71.62 R9.P1 11.59,68.97 | v6.51,57.07 6.51,61.35 12.39,67.23 12.39,67.83 11.59,68.63 11.59,68.97 | v7.88,55.71 8.02,55.58 C76.P2 | R39.P1 13.49,70.87 11.59,68.97 | C43.P1 83.83,58.27 81.58,58.27 v81.49,58.18 82.56,59.25 82.56,62.64 81.48,63.72 U6.GND@2 83.17,63.72 v83.33,63.88
LED-GND  (via drill 0.35)  (6 unrouted)
  Top 0.152: LED1.GND 9.3,68.1 9.76,68.56 18.21,68.56 19.47,67.3 LED2.GND 25.3,68.3 38.3,68.3 LED3.GND 39.3,67.35 | 39.3,67.35 39.3,68.04 39.71,68.45 46.02,68.45 47.17,67.3 LED4.GND 55.5,68.5 60.79,68.5 60.79,68.49 61.98,67.3 LED5.GND 70.35,68.35 76.2,68.35 77.25,67.3 LED6.GND | LED7.GND 9.3,58.36 9.55,58.61 16.45,58.61 17.76,57.3 LED8.GND 24.3,58.14 24.55,58.39 31.4,58.39 32.49,57.3 LED9.GND 39.3,58.14 39.7,58.54 46.08,58.54 47.32,57.3 LED10.GND 54.3,58.18 54.55,58.43 61.42,58.43 62.55,57.3 LED11.GND 69.3,58.19 69.51,58.4 76.34,58.4 77.44,57.3 LED12.GND | LED14.GND 23.98,47.3 | 23.98,47.3 17.09,47.3 15.85,48.54 10.54,48.54 LED13.GND | 23.98,47.3 25.13,48.45 30.87,48.45 32.02,47.3 LED15.GND 40.64,48.64 46.67,48.64 48.01,47.3 LED16.GND 55.43,48.43 62.24,48.43 63.37,47.3 LED17.GND 70.2,48.2 76.85,48.2 77.75,47.3 LED18.GND | LED24.GND 77.91,37.3 77.04,38.17 70.17,38.17 LED23.GND 62.42,37.3 60.97,38.75 55.75,38.75 LED22.GND 47.46,37.3 46.12,38.64 40.64,38.64 LED21.GND 32.2,37.3 31.02,38.48 25.48,38.48 LED20.GND 16.91,37.3 15.7,38.51 10.51,38.51 LED19.GND 5.49,37.3 4.69,36.5 v3.86,36.5 | LED36.GND 77.78,17.3 76.53,18.55 70.55,18.55 LED35.GND 62.74,17.3 61.46,18.58 55.58,18.58 LED34.GND 47.78,17.3 46.5,18.58 40.58,18.58 LED33.GND 32.97,17.3 31.5,18.77 25.77,18.77 LED32.GND 17.3,17.3 16.05,18.55 10.55,18.55 LED31.GND 6.2,17.3 v4.29,15.39 | LED42.GND 77.18,7.3 75.89,8.59 70.59,8.59 LED41.GND 66.1,7.3 65.74,6.94 61.94,6.94 61.06,7.82 61.06,8.01 60.36,8.71 55.71,8.71 LED40.GND 47.64,7.3 46.31,8.63 40.63,8.63 LED39.GND 32.87,7.3 31.65,8.52 25.52,8.52 LED38.GND 17.42,7.3 16.2,8.52 10.52,8.52 LED37.GND 8.12,8.48 v4.27,8.48
  Top 0.152: v4.39,24.74 8.27,24.74 8.7,25.17 8.7,26.7 LED25.GND 10.49,28.49 16.04,28.49 17.23,27.3 LED26.GND 25.64,28.64 30.8,28.64 32.14,27.3 LED27.GND 40.49,28.49 46.41,28.49 47.6,27.3 LED28.GND 56.18,29.18 65.53,29.18 67.41,27.3 LED29.GND 70.58,28.58 76.17,28.58 77.45,27.3 LED30.GND 85.21,28.21 v85.21,28.68 91.66,28.68 91.67,28.67 92.53,28.67 92.69,28.51 94.77,28.51 | v42.79,67.32 39.33,67.32 39.3,67.35
  Bottom 0.152: C15.P1 2.82,36.88 2.79,36.85 | 2.79,36.85 C14.P1 3.1,36.5 v3.86,36.5 | 2.79,36.85 C13.P1 2.82,34.85 C12.P1 2.92,32.98 C11.P1 2.98,31.14 C10.P1 2.98,26.72 C9.P1 2.91,26.65 C8.P1 2.91,23.12 C7.P1 2.92,23.07 C6.P1 2.97,21.1 | 2.97,21.1 3.02,21.05 C5.P1 C4.P1 C3.P1 C2.P1 3.05,14.15 | 3.05,14.15 C1.P1 3.05,9.7 v4.27,8.48 | v4.29,15.39 3.05,14.15 | v4.39,24.74 4.28,24.74 3.64,24.1 3.64,21.73 3.01,21.1 2.97,21.1 | C36.P1 95.56,26.71 C35.P1 C34.P1 | C34.P1 95.45,28.56 C33.P1 95.42,30.48 C32.P1 95.39,32.33 C31.P1 95.42,34.18 C30.P1 95.43,37.94 | C29.P1 95.43,37.94 | 95.43,37.94 95.39,37.98 C28.P1 C27.P1 95.48,41.99 C26.P1 C25.P1 C24.P1 | C37.P1 38.41,55.47 C38.P1 38.31,55.61 C39.P1 38.26,57.46 C40.P1 C41.P1 38.32,60.99 C42.P1 C19.P1 | C18.P1 38.33,67.65 C17.P1 38.36,69.39 C16.P1 38.48,69.51 C20.P1 38.5,71.16 C21.P1 38.64,72.76 C22.P1 38.67,74.72 C23.P1 | C34.P1 95.41,28.46 | C34.P1 94.79,28.53 | Q1.SOURCE 43.84,68.37 v42.79,67.32
LED-POW-EN
  Bottom 0.152: R1.P2 50.2,68.35 Q1.GATE
LED-PWR-EN
  Bottom 0.152: U7.PB5 U7.PB4 U7.PB3
LEDS-DATA  (1 unrouted)
  Bottom 0.152: R3.P2 8.9,76.98 R7.P2
LEDS-SCK  (1 unrouted)
  Bottom 0.152: R9.P2 9.07,67.53 4.17,72.43 R13.P2
N$1
  Top 0.152: LED1.DO 23.51,72.7 23.57,72.64 24.24,72.64 LED2.DI
N$2
  Top 0.152: LED1.CO LED2.CI
N$3
  Top 0.152: LED2.DO LED3.DI
N$4
  Top 0.152: LED2.CO LED3.CI
N$5
  Top 0.152: LED3.DO LED4.DI
N$6
  Top 0.152: LED3.CO LED4.CI
N$7
  Top 0.152: LED4.DO LED5.DI
N$8
  Top 0.152: LED4.CO LED5.CI
N$9
  Top 0.152: LED5.DO LED6.DI
N$10
  Top 0.152: LED5.CO LED6.CI
N$11  (via drill 0.35)
  Top 0.152: LED6.DO 89.59,72.59 89.54,72.64 v87.76,72.64 | LED7.DI 9.3,64.3 10.15,65.15 86.38,65.15 v86.78,65.55
  Bottom 0.152: v86.78,65.55 86.78,71.66 v87.76,72.64
N$12  (via drill 0.35)
  Top 0.152: LED7.CI 9.3,60.83 10.53,62.05 10.53,63.47 11.78,64.72 86.83,64.72 v87.66,65.55 | v88.23,69.98 89.68,69.98 LED6.CO
  Bottom 0.152: v87.66,65.55 87.66,69.41 v88.23,69.98
N$13
  Top 0.152: LED8.DO LED9.DI
N$14
  Top 0.152: LED8.CO 29.72,60.02 39.28,60.02 LED9.CI
N$15
  Top 0.152: LED9.DO LED10.DI
N$16
  Top 0.152: LED9.CO LED10.CI
N$17
  Top 0.152: LED10.DO LED11.DI
N$18
  Top 0.152: LED10.CO LED11.CI
N$19
  Top 0.152: LED11.DO LED12.DI
N$20
  Top 0.152: LED11.CO LED12.CI
N$21  (via drill 0.35)
  Top 0.152: v87.9,62.64 89.64,62.64 LED12.DO | v86.77,55.08 86.39,55.46 11.27,55.46 11.17,55.36 v11.17,55.02 | v9.58,53.7 9.58,52.98 LED13.DI
  Bottom 0.152: v86.77,55.08 86.77,61.51 v87.9,62.64 | v11.17,55.02 10.8,54.65 10.8,54.05 10.51,53.76 9.64,53.76 v9.58,53.7
N$22  (via drill 0.35)  (1 unrouted)
  Top 0.152: v87.77,55.21 87.04,54.48 11.7,54.48 v11.7,54.41 | v88.19,59.95 88.24,60 LED12.CO | v10.17,50.94 9.3,50.07 LED13.CI
  Bottom 0.152: v87.77,55.21 87.77,59.53 v88.19,59.95 | v11.7,54.41 10.67,53.38 | 10.67,53.38 10.66,53.37 | 9.25,49.96 9.25,49.84 | 10.67,53.38 10.67,51.44 v10.17,50.94
N$23
  Top 0.152: LED13.DO LED14.DI
N$24
  Top 0.152: LED13.CO LED14.CI
N$25
  Bottom 0.152: R29.P2 81.02,76.96 U6.SPI-CFG
N$27
  Bottom 0.152: X3.OUT 71.81,61.7 U6.RTC-CLK
N$28  (via drill 0.35)
  Top 0.152: v34.2,39.01 36.31,39.01 v36.57,39.27
  Bottom 0.152: R33.P2 32.38,30.98 34.25,32.85 34.25,38.96 v34.2,39.01 | v36.57,39.27 36.74,39.44 U7.PH1
N$29  (2 unrouted)
N$30
  Bottom 0.152: C54.P2 37.42,47.73 | U7.PH0 36.23,43.3 35.59,43.94 34.13,43.94 33.09,42.9 32.65,42.9 32.34,43.21 32.34,43.65 34.47,45.78 35.43,45.78 C54.P2 | X4.3 38.85,49.66 38.21,49.66 37.46,48.91 37.46,47.81 C54.P2
N$31  (via drill 0.35)
  Top 0.152: v18.06,41.83 40.05,41.83 v40.32,41.56
  Bottom 0.152: C55.P2 40.23,45.53 U7.VDDA 40.32,42.61 v40.32,41.56 | L4.P2 18.85,42.62 v18.06,41.83
N$32
  Bottom 0.152: R34.P2 47.89,32.52 45.71,34.7 U7.PB10
N$33
  Bottom 0.152: C59.P2 45.03,34.2 U7.VCAP
N$34
  Bottom 0.152: R35.P1 31.49,28.36 31.49,30.68 33.89,33.08 33.9,33.08 33.98,33.16 33.98,37.76 33.04,38.7 U7.BOOT0
N$35
  Bottom 0.152: R38.P2 28.85,47.15 ULD3.CATHODE
N$36  (1 unrouted)
N$37
  Bottom 0.152: U9.FB 11.01,36.45 R47.P1 8.99,38.47 R45.P2
N$38
  Bottom 0.152: R45.P1 8.4,40.66 R46.P2
N$39  (via drill 0.35)
  Top 0.152: v5.85,36.2 5.85,35.93 v5.13,35.21
  Bottom 0.152: R48.P2 5.77,36.28 v5.85,36.2 | v5.13,35.21 5.13,33.48 C71.P1
N$40
  Bottom 0.152: R48.P1 7.27,38.11 7.26,38.1 U9.BOOT
N$41  (via drill 0.35)
  Top 0.152: v26.44,11.62 40.79,11.62 v41.48,10.93 | v20.91,17.88 20.87,17.84 17.93,17.84 16.8,18.97 v4.07,18.97 | v7.28,27.8 5.2,27.8 5.12,27.72 v5.06,27.72
  Bottom 0.152: v26.44,11.62 25.25,11.62 D3.CATHODE 20.94,15.93 20.94,17.85 v20.91,17.88 | v41.48,10.93 42.6,9.81 L5.PIN1 | 7.43,29.65 U9.SW 7.25,27.82 v7.28,27.8 | v4.07,18.97 4.07,20.45 3.99,20.53 3.99,23.59 4.92,24.52 4.92,27.58 v5.06,27.72 5.27,27.93 5.27,29.3 5.83,29.86 C71.P2 4.92,31.28 3.96,32.24 R49.P1
N$42
  Bottom 0.152: C72.P1 4.01,34.94 R49.P2
N$43
  Bottom 0.152: R51.P2 7.36,15.37 7.36,19.22 U10.FB 6.39,19.23 R53.P1
N$44
  Bottom 0.152: R51.P1 R52.P2
N$45
  Bottom 0.152: C81.P1 14.62,15.53 R54.P2
N$46  (via drill 0.35)
  Top 0.152: v12.73,16.43 11.63,16.43 v11.56,16.5
  Bottom 0.152: R54.P1 12.73,15.92 v12.73,16.43 | v11.56,16.5 11.12,16.95 U10.BOOT
N$47  (via drill 0.35)
  Top 0.152: v59.28,23.82 v18.54,23.82 | v13.33,26.47 11.78,26.47 v11.77,26.46
  Bottom 0.152: D4.CATHODE 60.25,23.82 v59.28,23.82 | v18.54,23.82 17.52,24.84 17.52,46.73 18.3,47.51 18.95,47.51 19.18,47.74 L6.PIN1 12.37,43.1 12.37,25.02 11.59,24.23 U10.SW 11.12,25.8 v11.77,26.46 | v13.33,26.47 13.33,24.65 C81.P2 14.62,24.78 R55.P1
N$48  (via drill 0.35)  (1 unrouted)
  Bottom 0.152: R55.P2 16.6,28.84 v16.73,28.97
N$49
  Top 0.152: LED15.DO LED16.DI
N$50
  Top 0.152: LED15.CO LED16.CI
N$51
  Top 0.152: LED16.DO LED17.DI
N$52
  Top 0.152: LED16.CO LED17.CI
N$53
  Top 0.152: LED17.DO LED18.DI
N$54
  Top 0.152: LED17.CO LED18.CI
N$55  (via drill 0.35)
  Top 0.152: v84.79,44.78 83.97,45.6 v11.24,45.6 | v88.1,52.66 89.66,52.66 LED18.DO | v10.91,43.14 10.47,42.7 LED19.DI
  Bottom 0.152: v84.79,44.78 87.42,47.41 87.42,51.98 v88.1,52.66 | v11.24,45.6 10.91,45.27 v10.91,43.14
N$56  (via drill 0.35)
  Top 0.152: LED18.CO 88.79,50 v88.02,49.23 | v85.95,44.67 85.33,45.29 12.22,45.29 11.78,44.85 v11.78,44.83 | 11.46,40.95 v11.44,40.97 9.89,40.97 9.86,41 9.3,40.44 LED19.CI
  Bottom 0.152: v85.95,44.67 88.02,46.74 v88.02,49.23 | v11.78,44.83 11.51,44.56 11.51,40.97 v11.44,40.97
N$57
  Top 0.152: LED19.DO LED20.DI
N$58
  Top 0.152: LED19.CO LED20.CI
N$59
  Top 0.152: LED20.DO LED21.DI
N$60
  Top 0.152: LED20.CO LED21.CI
N$61
  Top 0.152: LED22.DO LED23.DI
N$62
  Top 0.152: LED22.CO LED23.CI
N$63
  Top 0.152: LED23.DO LED24.DI
N$64
  Top 0.152: LED23.CO LED24.CI
N$65  (via drill 0.35)
  Top 0.152: LED25.DI 9.3,34.3 9.95,34.95 84.64,34.95 v85.16,35.47 | v87.75,42.41 88.04,42.7 LED24.DO
  Bottom 0.152: v85.16,35.47 87.2,37.51 87.34,37.51 87.34,39.14 87.22,39.26 87.22,39.7 87.75,40.23 v87.75,42.41
N$66  (via drill 0.35)
  Top 0.152: LED25.CI 9.3,30.65 10.75,32.1 10.75,33.95 11.34,34.54 v85.06,34.54 | v87.75,39.48 88.27,40 LED24.CO
  Bottom 0.152: v85.06,34.54 87.75,37.23 v87.75,39.48
N$67
  Top 0.152: LED25.DO LED26.DI
N$68
  Top 0.152: LED25.CO LED26.CI
N$69
  Top 0.152: LED26.DO LED27.DI
N$70
  Top 0.152: LED27.CI LED26.CO
N$71
  Top 0.152: LED28.DI 54.27,32.73 44.73,32.73 LED27.DO
N$72
  Top 0.152: LED28.CI LED27.CO
N$73
  Top 0.152: LED29.DO LED30.DI
N$74
  Top 0.152: LED30.CI LED29.CO
N$75  (via drill 0.35)
  Top 0.152: LED30.DO v86.72,32.7 | LED31.DI 9.46,22.86 9.46,24.58 9.83,24.95 84.71,24.95 v85.12,25.36
  Bottom 0.152: v85.12,25.36 86.72,26.96 v86.72,32.7
N$76  (via drill 0.35)  (1 unrouted)
  Top 0.152: 84.47,24.35 11.27,24.35 10.74,23.82 10.74,21.44 LED31.CI | 84.47,24.35 | 84.47,24.35 v84.55,24.35 | v87.82,29.82 88,30 v89.64,30
  Bottom 0.152: v84.55,24.35 85.17,24.35 | 85.17,24.35 85.23,24.41 | 85.17,24.35 87.86,27.04 87.86,29.33 87.86,29.78 v87.82,29.82
N$77
  Top 0.152: LED31.DO LED32.DI
N$78
  Top 0.152: LED31.CO LED32.CI
N$79
  Top 0.152: LED32.DO LED33.DI
N$80
  Top 0.152: LED32.CO LED33.CI
N$81
  Top 0.152: LED33.DO LED34.DI
N$82
  Top 0.152: LED33.CO LED34.CI
N$83
  Top 0.152: LED34.DO LED35.DI
N$84
  Top 0.152: LED34.CO LED35.CI
N$85  (via drill 0.35)
  Top 0.152: LED37.DI 9.3,13.67 10.2,14.57 84.06,14.57 84.41,14.92 v84.41,15 | v87.87,22.52 88.05,22.7 LED36.DO
  Bottom 0.152: v84.41,15 86.19,16.78 86.19,20.84 v87.87,22.52
N$86  (via drill 0.35)
  Top 0.152: LED36.CO v87.58,20 | LED37.CI 11.15,11.85 11.15,13.38 11.79,14.02 v84.37,14.02
  Bottom 0.152: v84.37,14.02 86.48,16.13 86.48,18.9 v87.58,20
N$87
  Top 0.152: LED37.DO LED38.DI
N$88
  Top 0.152: LED38.CI LED37.CO
N$89
  Top 0.152: LED38.DO LED39.DI
N$90
  Top 0.152: LED39.CI LED38.CO
N$91
  Top 0.152: LED39.DO LED40.DI
N$92
  Top 0.152: LED40.CI LED39.CO
N$93
  Top 0.152: LED40.DO LED41.DI
N$94
  Top 0.152: LED41.CI LED40.CO
N$95
  Top 0.152: LED41.DO LED42.DI
N$96
  Top 0.152: LED42.CI LED41.CO
N$97  (1 unrouted)
  Bottom 0.152: Q3.GATE 76.54,46.72 Q2.DRAIN 78.44,48.34 R2.P1
N$98  (1 unrouted)
  Bottom 0.152: R4.P1 78.98,53.22 77.91,53.22 Q3.DRAIN
N$99  (via drill 0.35)
  Top 0.152: v6.56,54.52 10.84,54.52 11.48,53.88 70.38,53.88 v71.46,52.8
  Bottom 0.152: Q5.GATE 72.12,46.82 Q4.DRAIN 72.12,52.14 v71.46,52.8 | R12.P2 5.93,67 | 5.93,67 5.93,55.15 v6.56,54.52 | R8.P1 7.18,65.92 6.1,67 5.93,67
N$100  (via drill 0.35)
  Top 0.152: v5.52,44.2 6.08,44.76 69.3,44.76 71.05,43.01 v72.02,43.01
  Bottom 0.152: R11.P2 4.09,45.63 v5.52,44.2 5.52,41.17 R10.P1 | v72.02,43.01 73.11,44.1 Q5.DRAIN
NTC  (1 unrouted)
  Bottom 0.152: R37.P2 29.03,64.05 R36.P1
ULD0
  Bottom 0.152: 27.94,46.56 ULD3.ANODE 27.78,42.25 30.83,39.2 U7.PB8
ULD1
  Bottom 0.152: U7.PB9 32.11,39.82 31.54,39.82 30.29,41.07 ULD4.ANODE
WIFI-CS  (via drill 0.35)
  Top 0.152: v42.22,41.56 42.63,41.97 55.37,41.97 55.48,42.08 55.48,43.32 55.37,43.43 51.26,43.43 v50.75,43.94
  Bottom 0.152: U6.SPI-SSN 50.75,48.85 v50.75,43.94 | v42.22,41.56 42.75,41.03 44.4,41.03 45.09,40.34 46.41,40.34 47.31,39.44 47.31,39.21 47.42,39.1 47.42,38.66 47.34,38.58 47.34,37.16 46.27,37.16 44.4,39.03 43.9,39.03 U7.PA4
WIFI-EN  (via drill 0.35)  (1 unrouted)
  Top 0.152: v77.28,58.85 73.13,58.85 v72.43,59.55
  Bottom 0.152: R31.P2 77.37,58.76 v77.28,58.85 | v72.43,59.55 72.98,60.1 U6.CHIP-EN
WIFI-IRQ  (via drill 0.35)
  Top 0.152: v50.15,35.48 v45.78,35.48 v45.77,35.49
  Bottom 0.152: U6.IRQN 65,72.73 64.6,72.73 48.16,56.29 48.16,39.26 50.15,37.27 v50.15,35.48 | U7.PB0 43.9,36.03 44.4,36.03 44.94,35.49 v45.77,35.49
WIFI-MISO  (1 unrouted)
  Bottom 0.152: 5.01,55.32 6.34,53.99 6.78,53.99 7.09,54.3 7.09,56.38 11.77,61.06 35.62,61.06 37.41,59.27 37.41,53.59 38.11,52.89 40.21,52.89 42.7,55.38 42.7,61.26 43.96,62.52 45.21,62.52 46.55,63.86 46.55,69.69 44.65,71.59 44.35,71.59 44.24,71.7 44.24,78.84 44.35,78.95 51.49,78.95 51.6,78.84 51.6,71.7 51.49,71.59 51.19,71.59 49.29,69.69 49.29,66.03 49.5,65.82 56.48,65.82 64.6,73.94 66.63,73.94 66.74,73.83 66.74,71.67 66.63,71.56 64.64,71.56 61.66,68.58 61.66,63.66 61.97,63.35 63.65,63.35 64.6,64.3 66.63,64.3 66.74,64.2 66.74,61.96 U6.SPI-MISO | 5.01,55.32 4.89,55.44 | 5.01,55.32
WIFI-MOSI  (1 unrouted)
WIFI-RESET  (via drill 0.35)  (1 unrouted)
  Top 0.152: v81.79,60.77 82.36,61.34 v84.05,61.34
  Bottom 0.152: U6.RESETN 81.79,70.94 84.8,67.93 C43.P2 84.65,60.74 v84.05,61.34 | R30.P2 81.77,60.79 v81.79,60.77
WIFI-SCK  (1 unrouted)

## Text on the board
tNames: TK402 2022 Zadaca III
bNames: TK402 2022 Zadaca III